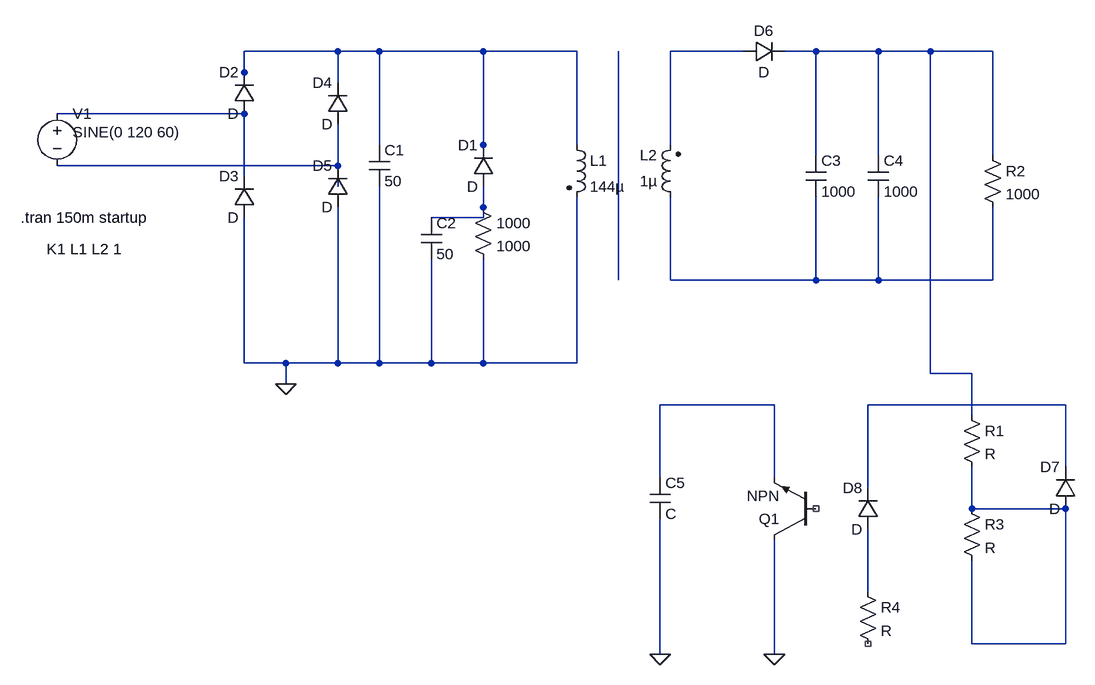
[diagram p0: schematic switched_psu.asc]
switched_psu.asc, the LTspice schematic file:
Version 4
SHEET 1 1204 680
WIRE 64 -544 -80 -544
WIRE 128 -544 64 -544
WIRE 288 -544 128 -544
WIRE 432 -544 288 -544
WIRE 688 -544 576 -544
WIRE 800 -544 752 -544
WIRE 896 -544 800 -544
WIRE 976 -544 896 -544
WIRE 1072 -544 976 -544
WIRE -80 -512 -80 -544
WIRE -80 -496 -80 -512
WIRE 64 -496 64 -544
WIRE -80 -448 -368 -448
WIRE 128 -400 128 -544
WIRE 288 -400 288 -544
WIRE 432 -400 432 -544
WIRE 576 -400 576 -544
WIRE 288 -384 288 -400
WIRE 800 -384 800 -544
WIRE 896 -384 896 -544
WIRE 1072 -384 1072 -544
WIRE 64 -368 64 -432
WIRE 64 -368 -368 -368
WIRE -80 -352 -80 -448
WIRE 64 -336 64 -368
WIRE 288 -304 288 -336
WIRE 288 -288 288 -304
WIRE 288 -288 208 -288
WIRE 496 -192 496 -544
WIRE 576 -192 576 -320
WIRE 800 -192 800 -320
WIRE 800 -192 576 -192
WIRE 896 -192 896 -320
WIRE 896 -192 800 -192
WIRE 1072 -192 1072 -304
WIRE 1072 -192 896 -192
WIRE -80 -64 -80 -288
WIRE -16 -64 -80 -64
WIRE 64 -64 64 -304
WIRE 64 -64 -16 -64
WIRE 128 -64 128 -336
WIRE 128 -64 64 -64
WIRE 208 -64 208 -224
WIRE 208 -64 128 -64
WIRE 288 -64 288 -224
WIRE 288 -64 208 -64
WIRE 432 -64 432 -320
WIRE 432 -64 288 -64
WIRE 976 -48 976 -544
WIRE 1040 -48 976 -48
WIRE -16 -32 -16 -64
WIRE 736 0 560 0
WIRE 1184 0 880 0
WIRE 1040 16 1040 -48
WIRE 1184 96 1184 0
WIRE 560 112 560 0
WIRE 736 112 736 0
WIRE 880 128 880 0
WIRE 1040 160 1040 96
WIRE 1184 160 1040 160
WIRE 880 288 880 192
WIRE 1040 368 1040 240
WIRE 1184 368 1184 160
WIRE 1184 368 1040 368
WIRE 560 384 560 176
WIRE 736 384 736 208
FLAG -16 -32 0
FLAG 736 384 0
FLAG 560 384 0
SYMBOL voltage -368 -464 R0
WINDOW 3 24 44 Left 2
WINDOW 123 24 44 Left 2
WINDOW 39 0 0 Left 0
SYMATTR Value SINE(0 120 60)
SYMATTR InstName V1
SYMBOL diode -64 -448 R180
WINDOW 0 24 64 Left 2
WINDOW 3 24 0 Left 2
SYMATTR InstName D2
SYMBOL diode -64 -288 R180
WINDOW 0 24 64 Left 2
WINDOW 3 24 0 Left 2
SYMATTR InstName D3
SYMBOL diode 80 -432 R180
WINDOW 0 24 64 Left 2
WINDOW 3 24 0 Left 2
SYMATTR InstName D4
SYMBOL diode 80 -304 R180
WINDOW 0 24 64 Left 2
WINDOW 3 24 0 Left 2
SYMATTR InstName D5
SYMBOL cap 112 -400 R0
SYMATTR InstName C1
SYMATTR Value 50
SYMBOL diode 304 -336 R180
WINDOW 0 24 64 Left 2
WINDOW 3 24 0 Left 2
SYMATTR InstName D1
SYMBOL res 272 -320 R0
SYMATTR InstName 1000
SYMATTR Value 1000
SYMBOL cap 192 -288 R0
SYMATTR InstName C2
SYMATTR Value 50
SYMBOL ind2 416 -416 R0
SYMATTR InstName L1
SYMATTR Value 144µ
SYMATTR Type ind
SYMBOL ind2 592 -304 R180
WINDOW 0 36 80 Left 2
WINDOW 3 36 40 Left 2
SYMATTR InstName L2
SYMATTR Value 1µ
SYMATTR Type ind
SYMBOL diode 688 -528 R270
WINDOW 0 32 32 VTop 2
WINDOW 3 0 32 VBottom 2
SYMATTR InstName D6
SYMBOL cap 784 -384 R0
SYMATTR InstName C3
SYMATTR Value 1000
SYMBOL cap 880 -384 R0
SYMATTR InstName C4
SYMATTR Value 1000
SYMBOL res 1056 -400 R0
SYMATTR InstName R2
SYMATTR Value 1000
SYMBOL res 1024 0 R0
SYMATTR InstName R1
SYMBOL diode 1200 160 R180
WINDOW 0 24 64 Left 2
WINDOW 3 24 0 Left 2
SYMATTR InstName D7
SYMBOL res 1024 144 R0
SYMATTR InstName R3
SYMBOL diode 896 192 R180
WINDOW 0 24 64 Left 2
WINDOW 3 24 0 Left 2
SYMATTR InstName D8
SYMBOL res 864 272 R0
SYMATTR InstName R4
SYMBOL npn 800 208 R180
SYMATTR InstName Q1
SYMBOL cap 544 112 R0
SYMATTR InstName C5
TEXT -424 -288 Left 2 !.tran 150m startup
TEXT -384 -240 Left 2 !K1 L1 L2 1

The netlist it stands for:
* switched_psu.asc
V1 N004 N005 SINE(0 120 60)
D2 N004 N001 D
D3 0 N004 D
D4 N005 N001 D
D5 0 N005 D
C1 N001 0 50
D1 N006 N001 D
R§1000 N006 0 1000
C2 N006 0 50
L1 N001 0 144µ
L2 N008 N002 1µ
D6 N002 N003 D
C3 N003 N008 1000
C4 N003 N008 1000
R2 N003 N008 1000
R1 N003 N011 R
D7 N011 N010 D
R3 N011 N011 R
D8 N012 N010 D
R4 N012 NC_01 R
Q1 0 NC_02 N009 0 NPN
C5 N009 0 C
.model D D
.lib standard.dio
.model NPN NPN
.model PNP PNP
.lib standard.bjt
.tran 150m startup
K1 L1 L2 1
.backanno
.end